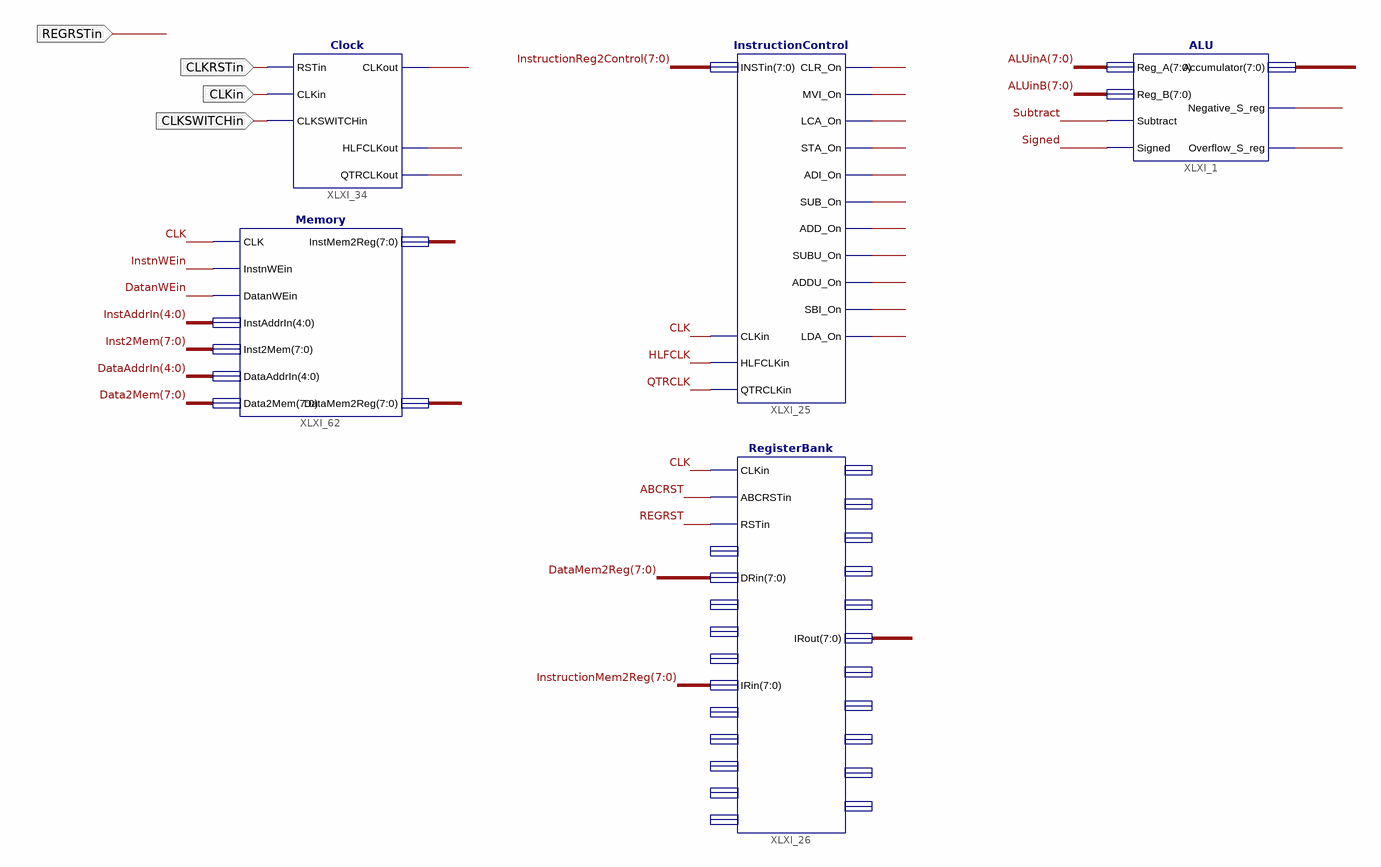
[diagram p0: schematic sheet 1]
// Xilinx ISE schematic Machine.sch (spartan3e) as structural Verilog: 5 symbols, 4 ports
module Machine (
  input  CLKRSTin,
  input  CLKin,
  input  CLKSWITCHin,
  input  REGRSTin
);

  wire ABCRST, CLK, DatanWEin, HLFCLK, InstnWEin, Negative_Sout, Overflow_Sout, QTRCLK, REGRST, Signed,
       Subtract, XLXN_195, XLXN_196, XLXN_197, XLXN_198, XLXN_199, XLXN_200, XLXN_201, XLXN_204, XLXN_205,
       XLXN_378, XLXN_383;
  wire [4:0] DataAddrIn, InstAddrIn;
  wire [7:0] AccumulatorIn, ALUinA, ALUinB, Data2Mem, DataMem2Reg, Inst2Mem, InstMem2Reg, InstructionMem2Reg,
       InstructionReg2Control;

  Clock XLXI_34 (
    .RSTin(CLKRSTin), .CLKin(CLKin), .CLKSWITCHin(CLKSWITCHin), .CLKout(CLK), .HLFCLKout(HLFCLK),
    .QTRCLKout(QTRCLK));
  Memory XLXI_62 (
    .CLK(CLK), .InstnWEin(InstnWEin), .DatanWEin(DatanWEin), .InstAddrIn(InstAddrIn), .Inst2Mem(Inst2Mem),
    .DataAddrIn(DataAddrIn), .Data2Mem(Data2Mem), .InstMem2Reg(InstMem2Reg), .DataMem2Reg(DataMem2Reg));
  InstructionControl XLXI_25 (
    .INSTin(InstructionReg2Control), .CLKin(CLK), .CLR_On(XLXN_195), .MVI_On(XLXN_196), .LCA_On(XLXN_197),
    .STA_On(XLXN_198), .ADI_On(XLXN_199), .SUB_On(XLXN_200), .ADD_On(XLXN_201), .SUBU_On(XLXN_383),
    .ADDU_On(XLXN_378), .SBI_On(XLXN_204), .LDA_On(XLXN_205), .HLFCLKin(HLFCLK), .QTRCLKin(QTRCLK));
  RegisterBank XLXI_26 (
    .CLKin(CLK), .ABCRSTin(ABCRST), .RSTin(REGRST), .DRin(DataMem2Reg), .IRin(InstructionMem2Reg),
    .IRout(InstructionReg2Control));  // open: R0in, Ain, R1in, Bin, Zin, Cin, R2in, R3in, Sin, R0out, DRout, Aout, R1out, Bout, Zout, Cout, R2out, R3out, Sout
  ALU XLXI_1 (
    .Reg_A(ALUinA), .Reg_B(ALUinB), .Subtract(Subtract), .Signed(Signed), .Accumulator(AccumulatorIn),
    .Negative_S_reg(Negative_Sout), .Overflow_S_reg(Overflow_Sout));
endmodule
